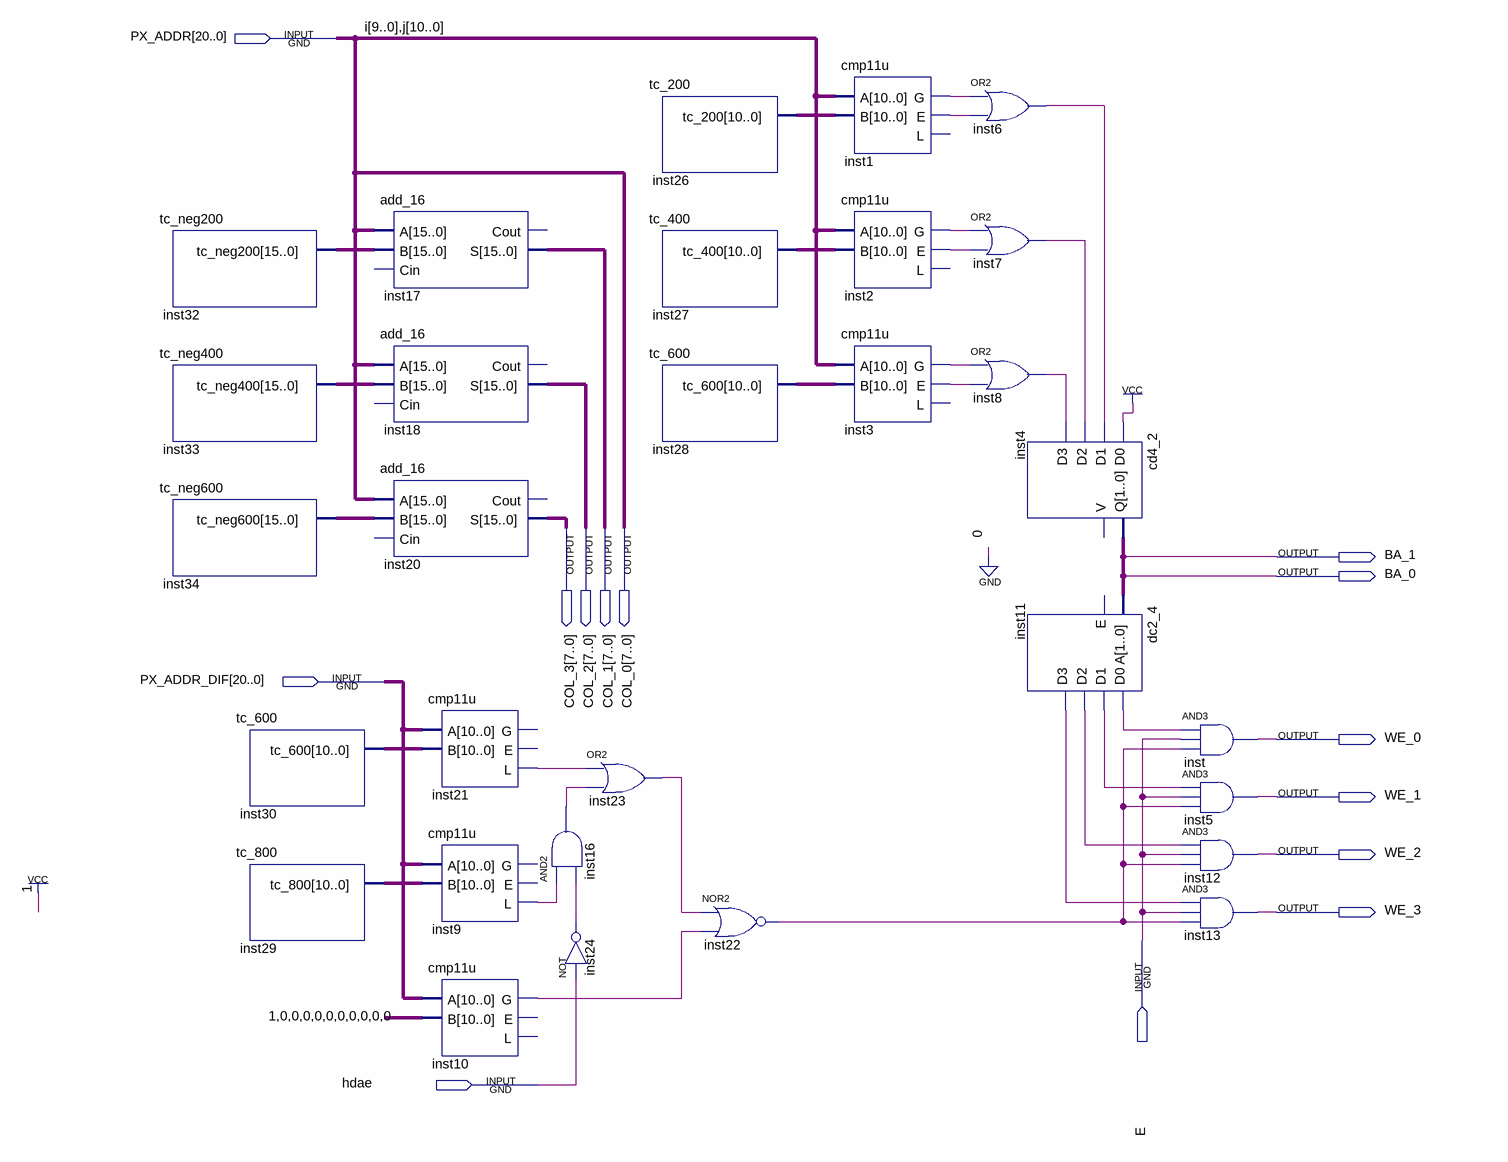
[diagram p0: schematic sheet]
// Quartus schematic wtc_addr_dc.bdf as structural Verilog: 30 symbols, 14 pins
module wtc_addr_dc (
  input  [20:0] PX_ADDR,
  input  [20:0] PX_ADDR_DIF,
  input  E,
  input  hdae,
  output [7:0] COL_3,
  output [7:0] COL_2,
  output [7:0] COL_1,
  output [7:0] COL_0,
  output BA_1,
  output BA_0,
  output WE_0,
  output WE_1,
  output WE_2,
  output WE_3
);

  wire inst1_e, inst1_g, inst2_e, inst2_g, inst3_e, inst3_g, inst6_out, inst7_out, inst8_out, inst9_l,
       inst10_g, inst11_d0, inst11_d1, inst11_d2, inst11_d3, inst16_out, inst21_l, inst22_out, inst23_out,
       inst24_out;
  wire [10:0] inst26_tc_200, inst27_tc_400, inst28_tc_600, inst29_tc_800, inst30_tc_600;
  wire [15:0] inst32_tc_neg200, inst33_tc_neg400, inst34_tc_neg600;
  wire [15:8] col1, col2, col3;

  tc_neg200 inst32 (.tc_neg200(inst32_tc_neg200));
  tc_neg400 inst33 (.tc_neg400(inst33_tc_neg400));
  tc_neg600 inst34 (.tc_neg600(inst34_tc_neg600));
  tc_600 inst30 (.tc_600(inst30_tc_600));
  tc_800 inst29 (.tc_800(inst29_tc_800));
  add_16 inst17 (.A({{5{1'b0}}, PX_ADDR[10:0]}), .B(inst32_tc_neg200), .S({col1, COL_1}));  // open: Cin, Cout
  add_16 inst18 (.A({{5{1'b0}}, PX_ADDR[10:0]}), .B(inst33_tc_neg400), .S({col2, COL_2}));  // open: Cin, Cout
  add_16 inst20 (.A({{5{1'b0}}, PX_ADDR[10:0]}), .B(inst34_tc_neg600), .S({col3, COL_3}));  // open: Cin, Cout
  cmp11u inst21 (.A({1'b0, PX_ADDR_DIF[20:11]}), .B(inst30_tc_600), .L(inst21_l));  // open: G, E
  cmp11u inst9 (.A(PX_ADDR_DIF[10:0]), .B(inst29_tc_800), .L(inst9_l));  // open: G, E
  cmp11u inst10 (.A(PX_ADDR_DIF[10:0]), .B(11'b10000000000), .G(inst10_g));  // open: E, L
  and inst16 (inst16_out, inst9_l, inst24_out);
  not inst24 (inst24_out, hdae);
  tc_200 inst26 (.tc_200(inst26_tc_200));
  tc_400 inst27 (.tc_400(inst27_tc_400));
  tc_600 inst28 (.tc_600(inst28_tc_600));
  or inst23 (inst23_out, inst21_l, inst16_out);
  nor inst22 (inst22_out, inst23_out, inst10_g);
  cmp11u inst1 (.A(PX_ADDR[10:0]), .B(inst26_tc_200), .G(inst1_g), .E(inst1_e));  // open: L
  cmp11u inst2 (.A(PX_ADDR[10:0]), .B(inst27_tc_400), .G(inst2_g), .E(inst2_e));  // open: L
  cmp11u inst3 (.A(PX_ADDR[10:0]), .B(inst28_tc_600), .G(inst3_g), .E(inst3_e));  // open: L
  or inst6 (inst6_out, inst1_g, inst1_e);
  or inst7 (inst7_out, inst2_g, inst2_e);
  or inst8 (inst8_out, inst3_g, inst3_e);
  cd4_2 inst4 (.D0(1'b1), .D1(inst6_out), .D2(inst7_out), .D3(inst8_out), .Q({BA_1, BA_0}));  // open: V
  dc2_4 inst11 (.A({BA_1, BA_0}), .D0(inst11_d0), .D1(inst11_d1), .D2(inst11_d2), .D3(inst11_d3));  // open: E
  and inst (WE_0, inst11_d0, E, inst22_out);
  and inst5 (WE_1, inst11_d1, E, inst22_out);
  and inst12 (WE_2, inst11_d2, E, inst22_out);
  and inst13 (WE_3, inst11_d3, E, inst22_out);

  assign COL_0 = PX_ADDR[7:0];

  // Other names for the same wires on the sheet: ba[1:0] = {BA_1, BA_0}; col1[7:0] = COL_1; col2[7:0] = COL_2;
  //   col3[7:0] = COL_3; dif_i[9:0] = PX_ADDR_DIF[20:11]; dif_j[10:0] = PX_ADDR_DIF[10:0]; i[9:0] = PX_ADDR[20:11];
  //   j[10:0] = PX_ADDR[10:0]
endmodule
